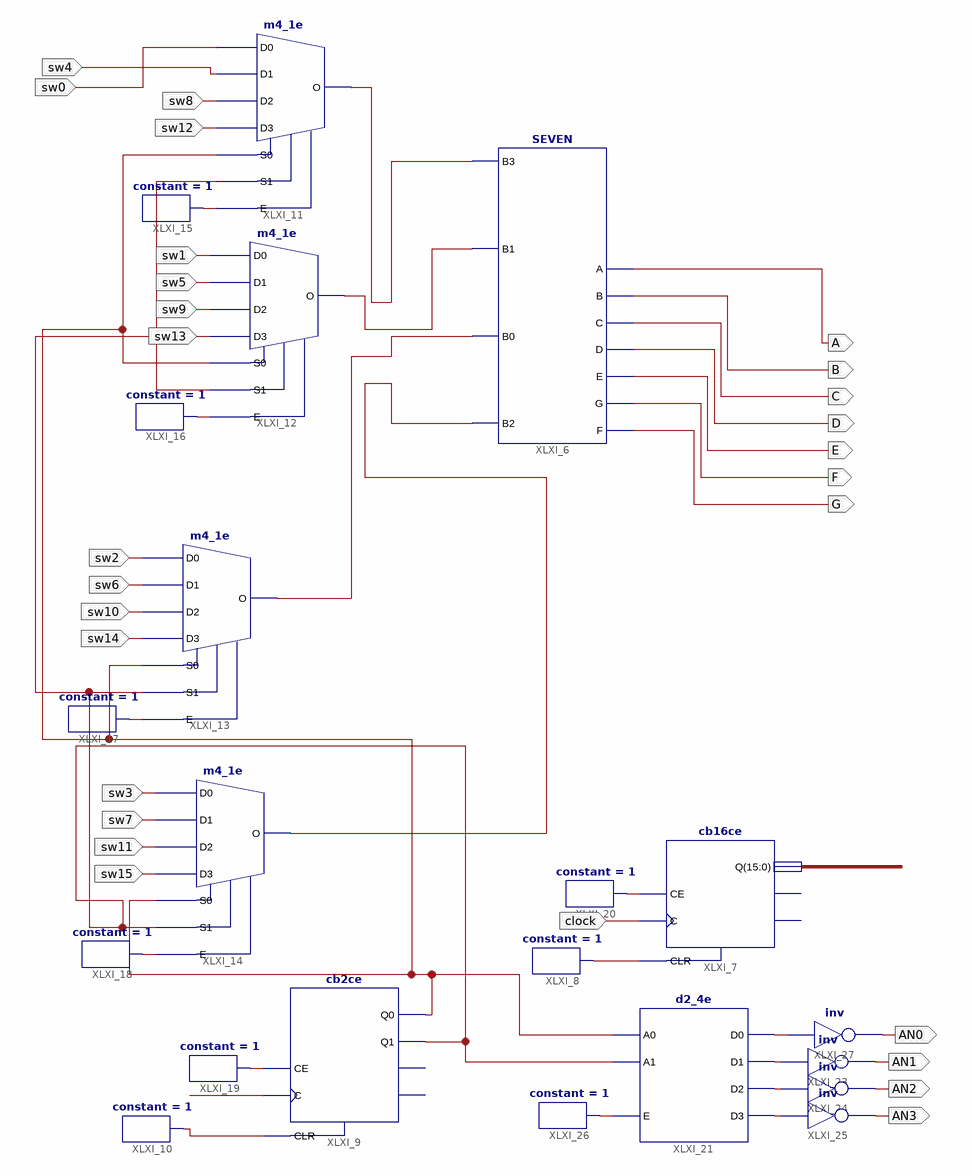
[diagram p0: schematic sheet 1]
// Xilinx ISE schematic FOURDIGIT.sch (spartan6) as structural Verilog: 21 symbols, 28 ports
module FOURDIGIT (
  input  sw4,
  input  sw0,
  input  clock,
  input  sw15,
  input  sw11,
  input  sw7,
  input  sw3,
  input  sw14,
  input  sw10,
  input  sw6,
  input  sw2,
  input  sw13,
  input  sw9,
  input  sw5,
  input  sw1,
  input  sw12,
  input  sw8,
  output A,
  output B,
  output C,
  output D,
  output E,
  output F,
  output G,
  output AN1,
  output AN2,
  output AN3,
  output AN0
);

  wire XLXN_54, XLXN_61, XLXN_80, XLXN_91, XLXN_92, XLXN_93, XLXN_97, XLXN_99, XLXN_100, XLXN_104, XLXN_105,
       XLXN_106, XLXN_117, XLXN_118, XLXN_122, XLXN_123, XLXN_124, XLXN_129, XLXN_130;
  wire [15:0] clk;

  SEVEN XLXI_6 (
    .B3(XLXN_91), .B1(XLXN_80), .B0(XLXN_92), .B2(XLXN_93), .A(A), .B(B), .C(C), .D(D), .E(E), .G(F), .F(G));
  cb16ce XLXI_7 (.C(clock), .CE(XLXN_118), .CLR(XLXN_54), .Q(clk));  // open: CEO, TC
  constant #(.CValue("1")) XLXI_8 (.O(XLXN_54));
  cb2ce XLXI_9 (.C(clk[15]), .CE(XLXN_117), .CLR(XLXN_61), .Q0(XLXN_97), .Q1(XLXN_99));  // open: CEO, TC
  constant #(.CValue("1")) XLXI_10 (.O(XLXN_61));
  m4_1e XLXI_11 (.D0(sw0), .D1(sw4), .D2(sw8), .D3(sw12), .E(XLXN_100), .S0(XLXN_97), .S1(XLXN_99), .O(XLXN_91));
  m4_1e XLXI_12 (.D0(sw1), .D1(sw5), .D2(sw9), .D3(sw13), .E(XLXN_104), .S0(XLXN_97), .S1(XLXN_99), .O(XLXN_80));
  m4_1e XLXI_13 (.D0(sw2), .D1(sw6), .D2(sw10), .D3(sw14), .E(XLXN_105), .S0(XLXN_97), .S1(XLXN_99), .O(XLXN_92));
  m4_1e XLXI_14 (.D0(sw3), .D1(sw7), .D2(sw11), .D3(sw15), .E(XLXN_106), .S0(XLXN_97), .S1(XLXN_99), .O(XLXN_93));
  constant #(.CValue("1")) XLXI_15 (.O(XLXN_100));
  constant #(.CValue("1")) XLXI_16 (.O(XLXN_104));
  constant #(.CValue("1")) XLXI_17 (.O(XLXN_105));
  constant #(.CValue("1")) XLXI_18 (.O(XLXN_106));
  constant #(.CValue("1")) XLXI_19 (.O(XLXN_117));
  constant #(.CValue("1")) XLXI_20 (.O(XLXN_118));
  d2_4e XLXI_21 (.A0(XLXN_97), .A1(XLXN_99), .E(XLXN_129), .D0(XLXN_130), .D1(XLXN_122), .D2(XLXN_123), .D3(XLXN_124));
  not XLXI_23 (AN1, XLXN_122);
  not XLXI_24 (AN2, XLXN_123);
  not XLXI_25 (AN3, XLXN_124);
  constant #(.CValue("1")) XLXI_26 (.O(XLXN_129));
  not XLXI_27 (AN0, XLXN_130);
endmodule
